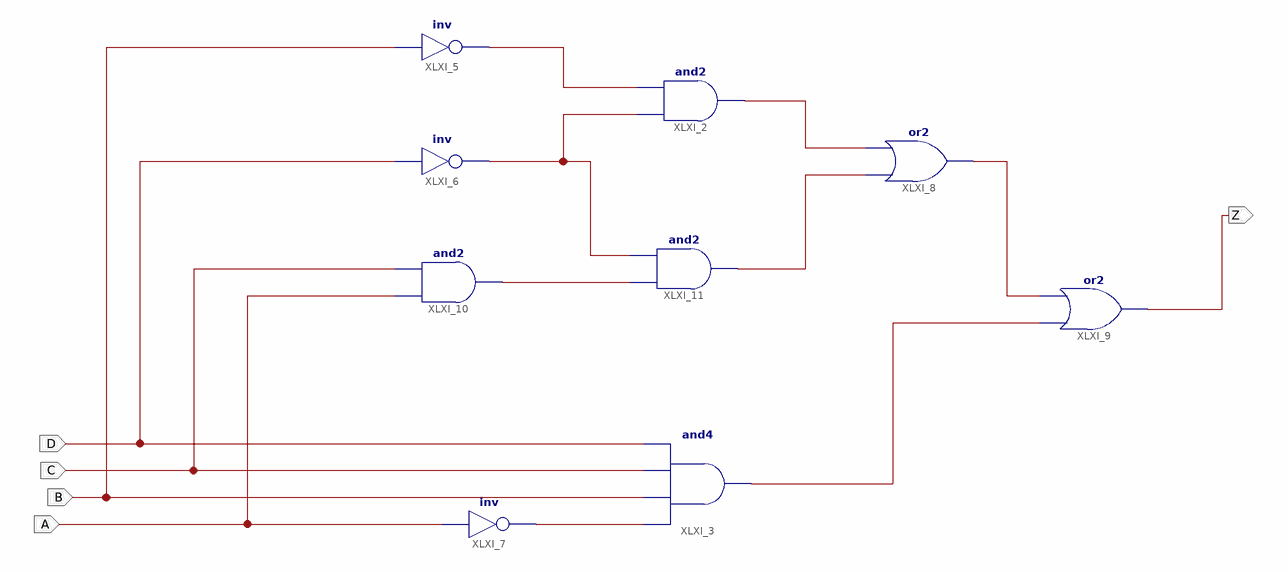
[diagram p0: schematic sheet 1]
// Xilinx ISE schematic circuito.sch (spartan3) as structural Verilog: 9 symbols, 5 ports
module circuito (
  input  B,
  input  D,
  input  C,
  input  A,
  output Z
);

  wire XLXN_5, XLXN_10, XLXN_28, XLXN_29, XLXN_30, XLXN_31, XLXN_32, XLXN_33;

  not XLXI_6 (XLXN_32, D);
  not XLXI_5 (XLXN_5, B);
  and XLXI_2 (XLXN_31, XLXN_32, XLXN_5);
  and XLXI_3 (XLXN_29, XLXN_10, B, C, D);
  not XLXI_7 (XLXN_10, A);
  or XLXI_8 (XLXN_28, XLXN_30, XLXN_31);
  or XLXI_9 (Z, XLXN_29, XLXN_28);
  and XLXI_10 (XLXN_33, A, C);
  and XLXI_11 (XLXN_30, XLXN_33, XLXN_32);
endmodule
